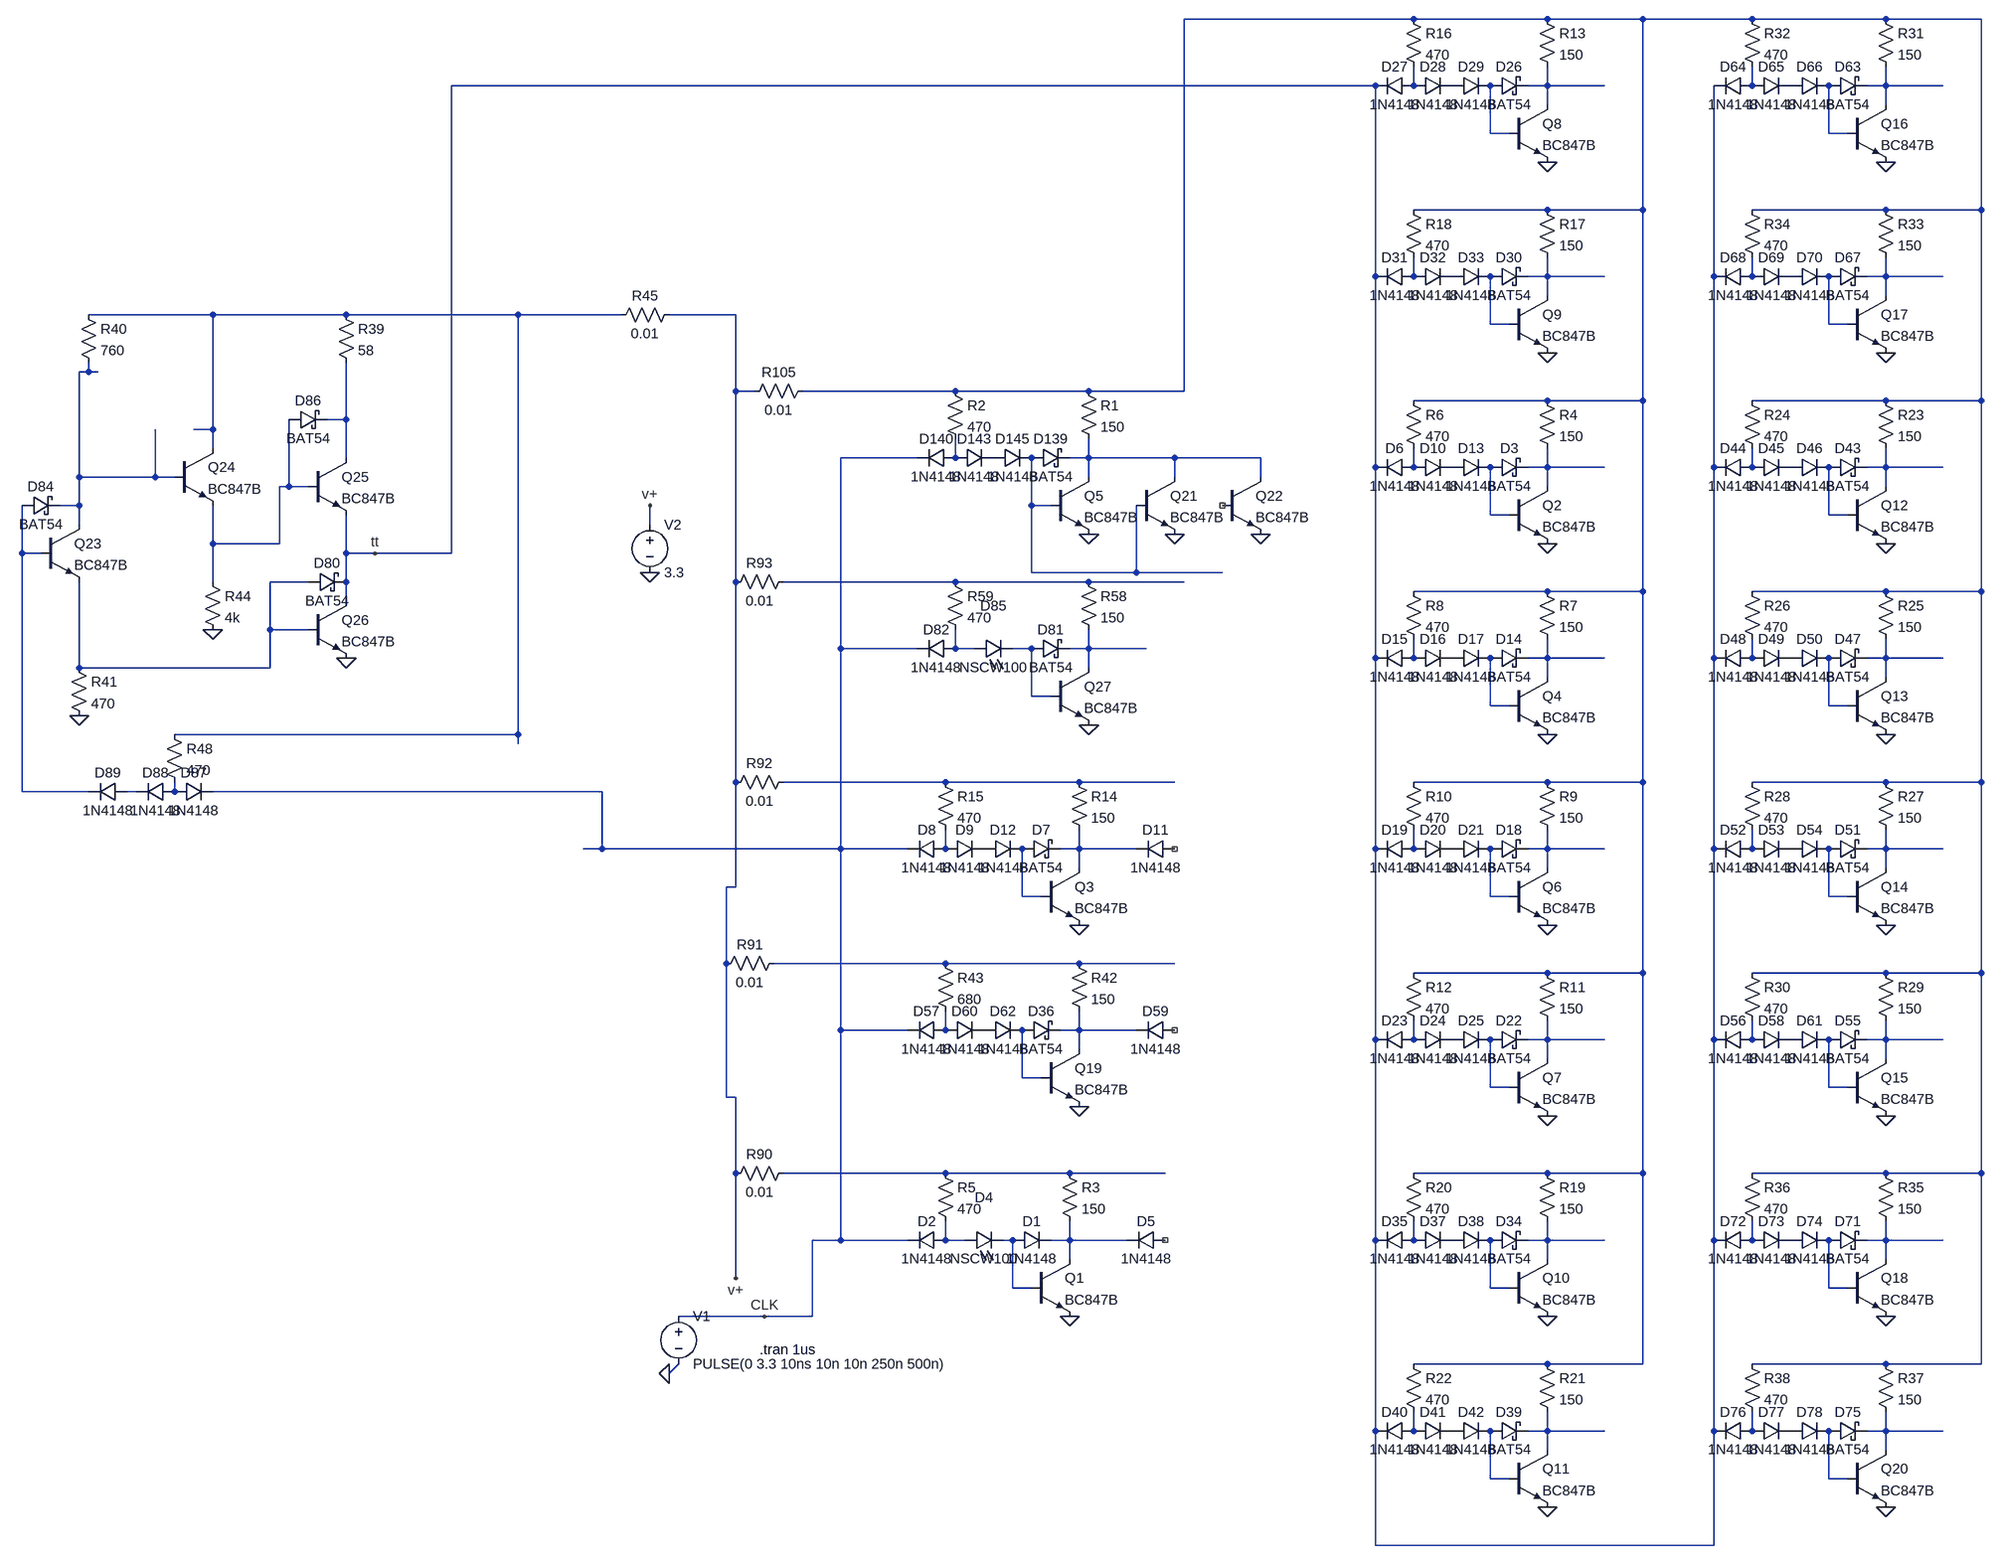
[diagram p0: schematic FanOutTest.asc]
FanOutTest.asc, the LTspice schematic file:
Version 4
SHEET 1 4484 1160
WIRE 1152 -2064 624 -2064
WIRE 1376 -2064 1152 -2064
WIRE 1536 -2064 1376 -2064
WIRE 1728 -2064 1536 -2064
WIRE 1952 -2064 1728 -2064
WIRE 2112 -2064 1952 -2064
WIRE 1088 -1952 -800 -1952
WIRE 1152 -1952 1152 -1984
WIRE 1376 -1952 1376 -1984
WIRE 1376 -1952 1344 -1952
WIRE 1472 -1952 1376 -1952
WIRE 1728 -1952 1728 -1984
WIRE 1952 -1952 1952 -1984
WIRE 1952 -1952 1920 -1952
WIRE 2048 -1952 1952 -1952
WIRE 1376 -1920 1376 -1952
WIRE 1952 -1920 1952 -1952
WIRE 1280 -1872 1280 -1952
WIRE 1312 -1872 1280 -1872
WIRE 1856 -1872 1856 -1952
WIRE 1888 -1872 1856 -1872
WIRE 1376 -1744 1152 -1744
WIRE 1536 -1744 1536 -2064
WIRE 1536 -1744 1376 -1744
WIRE 1952 -1744 1728 -1744
WIRE 2112 -1744 2112 -2064
WIRE 2112 -1744 1952 -1744
WIRE 1088 -1632 1088 -1952
WIRE 1152 -1632 1152 -1664
WIRE 1376 -1632 1376 -1664
WIRE 1376 -1632 1344 -1632
WIRE 1472 -1632 1376 -1632
WIRE 1664 -1632 1664 -1952
WIRE 1728 -1632 1728 -1664
WIRE 1952 -1632 1952 -1664
WIRE 1952 -1632 1920 -1632
WIRE 2048 -1632 1952 -1632
WIRE 1376 -1600 1376 -1632
WIRE 1952 -1600 1952 -1632
WIRE -1200 -1568 -1408 -1568
WIRE -976 -1568 -1200 -1568
WIRE -688 -1568 -976 -1568
WIRE -320 -1568 -688 -1568
WIRE -128 -1568 -240 -1568
WIRE 1280 -1552 1280 -1632
WIRE 1312 -1552 1280 -1552
WIRE 1856 -1552 1856 -1632
WIRE 1888 -1552 1856 -1552
WIRE -1408 -1472 -1408 -1488
WIRE -1408 -1472 -1424 -1472
WIRE -1392 -1472 -1408 -1472
WIRE -128 -1440 -128 -1568
WIRE -96 -1440 -128 -1440
WIRE 240 -1440 -16 -1440
WIRE 464 -1440 240 -1440
WIRE 624 -1440 624 -2064
WIRE 624 -1440 464 -1440
WIRE 1376 -1424 1152 -1424
WIRE 1536 -1424 1536 -1744
WIRE 1536 -1424 1376 -1424
WIRE 1952 -1424 1728 -1424
WIRE 2112 -1424 2112 -1744
WIRE 2112 -1424 1952 -1424
WIRE -976 -1392 -976 -1488
WIRE -976 -1392 -1008 -1392
WIRE -1200 -1376 -1200 -1568
WIRE -1200 -1376 -1232 -1376
WIRE -1200 -1344 -1200 -1376
WIRE -976 -1328 -976 -1392
WIRE 176 -1328 48 -1328
WIRE 240 -1328 240 -1360
WIRE 464 -1328 464 -1360
WIRE 464 -1328 432 -1328
WIRE 608 -1328 464 -1328
WIRE 752 -1328 608 -1328
WIRE 1088 -1312 1088 -1632
WIRE 1152 -1312 1152 -1344
WIRE 1376 -1312 1376 -1344
WIRE 1376 -1312 1344 -1312
WIRE 1472 -1312 1376 -1312
WIRE 1664 -1312 1664 -1632
WIRE 1728 -1312 1728 -1344
WIRE 1952 -1312 1952 -1344
WIRE 1952 -1312 1920 -1312
WIRE 2048 -1312 1952 -1312
WIRE -1424 -1296 -1424 -1472
WIRE -1296 -1296 -1296 -1376
WIRE -1296 -1296 -1424 -1296
WIRE -1264 -1296 -1296 -1296
WIRE 464 -1296 464 -1328
WIRE 608 -1296 608 -1328
WIRE 752 -1296 752 -1328
WIRE -1072 -1280 -1072 -1392
WIRE -1072 -1280 -1088 -1280
WIRE -1040 -1280 -1072 -1280
WIRE 1376 -1280 1376 -1312
WIRE 1952 -1280 1952 -1312
WIRE -1424 -1248 -1424 -1296
WIRE -1424 -1248 -1456 -1248
WIRE 368 -1248 368 -1328
WIRE 400 -1248 368 -1248
WIRE 1280 -1232 1280 -1312
WIRE 1312 -1232 1280 -1232
WIRE 1856 -1232 1856 -1312
WIRE 1888 -1232 1856 -1232
WIRE -1424 -1216 -1424 -1248
WIRE -272 -1216 -272 -1248
WIRE -1200 -1184 -1200 -1248
WIRE -1088 -1184 -1088 -1280
WIRE -1088 -1184 -1200 -1184
WIRE -1520 -1168 -1520 -1248
WIRE -1488 -1168 -1520 -1168
WIRE -976 -1168 -976 -1232
WIRE -928 -1168 -976 -1168
WIRE -800 -1168 -800 -1952
WIRE -800 -1168 -928 -1168
WIRE 368 -1136 368 -1248
WIRE 544 -1136 544 -1248
WIRE 544 -1136 368 -1136
WIRE 688 -1136 544 -1136
WIRE -1200 -1120 -1200 -1184
WIRE -1040 -1120 -1104 -1120
WIRE -976 -1120 -976 -1168
WIRE -128 -1120 -128 -1440
WIRE 240 -1120 -48 -1120
WIRE 464 -1120 240 -1120
WIRE 624 -1120 464 -1120
WIRE 1376 -1104 1152 -1104
WIRE 1536 -1104 1536 -1424
WIRE 1536 -1104 1376 -1104
WIRE 1952 -1104 1728 -1104
WIRE 2112 -1104 2112 -1424
WIRE 2112 -1104 1952 -1104
WIRE -976 -1088 -976 -1120
WIRE -1104 -1040 -1104 -1120
WIRE -1040 -1040 -1104 -1040
WIRE 48 -1008 48 -1328
WIRE 176 -1008 48 -1008
WIRE 240 -1008 240 -1040
WIRE 272 -1008 240 -1008
WIRE 368 -1008 336 -1008
WIRE 464 -1008 464 -1040
WIRE 464 -1008 432 -1008
WIRE 560 -1008 464 -1008
WIRE 1088 -992 1088 -1312
WIRE 1152 -992 1152 -1024
WIRE 1376 -992 1376 -1024
WIRE 1376 -992 1344 -992
WIRE 1472 -992 1376 -992
WIRE 1664 -992 1664 -1312
WIRE 1728 -992 1728 -1024
WIRE 1952 -992 1952 -1024
WIRE 1952 -992 1920 -992
WIRE 2048 -992 1952 -992
WIRE -1424 -976 -1424 -1120
WIRE -1104 -976 -1104 -1040
WIRE -1104 -976 -1424 -976
WIRE 464 -976 464 -1008
WIRE 1376 -960 1376 -992
WIRE 1952 -960 1952 -992
WIRE 368 -928 368 -1008
WIRE 400 -928 368 -928
WIRE 1280 -912 1280 -992
WIRE 1312 -912 1280 -912
WIRE 1856 -912 1856 -992
WIRE 1888 -912 1856 -912
WIRE -688 -864 -688 -1568
WIRE -688 -864 -1264 -864
WIRE -688 -848 -688 -864
WIRE -128 -784 -128 -1120
WIRE 224 -784 -48 -784
WIRE 448 -784 224 -784
WIRE 608 -784 448 -784
WIRE 1376 -784 1152 -784
WIRE 1536 -784 1536 -1104
WIRE 1536 -784 1376 -784
WIRE 1952 -784 1728 -784
WIRE 2112 -784 2112 -1104
WIRE 2112 -784 1952 -784
WIRE -1520 -768 -1520 -1168
WIRE -1408 -768 -1520 -768
WIRE -1328 -768 -1344 -768
WIRE -1264 -768 -1264 -784
WIRE -352 -768 -1200 -768
WIRE -352 -672 -352 -768
WIRE -352 -672 -384 -672
WIRE 48 -672 48 -1008
WIRE 48 -672 -352 -672
WIRE 160 -672 48 -672
WIRE 224 -672 224 -704
WIRE 448 -672 448 -704
WIRE 448 -672 416 -672
WIRE 544 -672 448 -672
WIRE 1088 -672 1088 -992
WIRE 1152 -672 1152 -704
WIRE 1376 -672 1376 -704
WIRE 1376 -672 1344 -672
WIRE 1472 -672 1376 -672
WIRE 1664 -672 1664 -992
WIRE 1728 -672 1728 -704
WIRE 1952 -672 1952 -704
WIRE 1952 -672 1920 -672
WIRE 2048 -672 1952 -672
WIRE 448 -640 448 -672
WIRE 1376 -640 1376 -672
WIRE 1952 -640 1952 -672
WIRE -128 -608 -128 -784
WIRE -128 -608 -144 -608
WIRE 352 -592 352 -672
WIRE 384 -592 352 -592
WIRE 1280 -592 1280 -672
WIRE 1312 -592 1280 -592
WIRE 1856 -592 1856 -672
WIRE 1888 -592 1856 -592
WIRE -144 -480 -144 -608
WIRE 224 -480 -64 -480
WIRE 448 -480 224 -480
WIRE 608 -480 448 -480
WIRE 1376 -464 1152 -464
WIRE 1536 -464 1536 -784
WIRE 1536 -464 1376 -464
WIRE 1952 -464 1728 -464
WIRE 2112 -464 2112 -784
WIRE 2112 -464 1952 -464
WIRE 48 -368 48 -672
WIRE 160 -368 48 -368
WIRE 224 -368 224 -400
WIRE 448 -368 448 -400
WIRE 448 -368 416 -368
WIRE 544 -368 448 -368
WIRE 1088 -352 1088 -672
WIRE 1152 -352 1152 -384
WIRE 1376 -352 1376 -384
WIRE 1376 -352 1344 -352
WIRE 1472 -352 1376 -352
WIRE 1664 -352 1664 -672
WIRE 1728 -352 1728 -384
WIRE 1952 -352 1952 -384
WIRE 1952 -352 1920 -352
WIRE 2048 -352 1952 -352
WIRE 448 -336 448 -368
WIRE 1376 -320 1376 -352
WIRE 1952 -320 1952 -352
WIRE 352 -288 352 -368
WIRE 384 -288 352 -288
WIRE 1280 -272 1280 -352
WIRE 1312 -272 1280 -272
WIRE 1856 -272 1856 -352
WIRE 1888 -272 1856 -272
WIRE -144 -256 -144 -480
WIRE -128 -256 -144 -256
WIRE -128 -128 -128 -256
WIRE 224 -128 -48 -128
WIRE 432 -128 224 -128
WIRE 592 -128 432 -128
WIRE 1376 -128 1152 -128
WIRE 1536 -128 1536 -464
WIRE 1536 -128 1376 -128
WIRE 1952 -128 1728 -128
WIRE 2112 -128 2112 -464
WIRE 2112 -128 1952 -128
WIRE 48 -16 48 -368
WIRE 48 -16 0 -16
WIRE 160 -16 48 -16
WIRE 224 -16 224 -48
WIRE 256 -16 224 -16
WIRE 336 -16 320 -16
WIRE 432 -16 432 -48
WIRE 432 -16 400 -16
WIRE 528 -16 432 -16
WIRE 1088 -16 1088 -352
WIRE 1152 -16 1152 -48
WIRE 1376 -16 1376 -48
WIRE 1376 -16 1344 -16
WIRE 1472 -16 1376 -16
WIRE 1664 -16 1664 -352
WIRE 1728 -16 1728 -48
WIRE 1952 -16 1952 -48
WIRE 1952 -16 1920 -16
WIRE 2048 -16 1952 -16
WIRE 432 16 432 -16
WIRE 1376 16 1376 -16
WIRE 1952 16 1952 -16
WIRE -128 48 -128 -128
WIRE 336 64 336 -16
WIRE 368 64 336 64
WIRE 1280 64 1280 -16
WIRE 1312 64 1280 64
WIRE 1856 64 1856 -16
WIRE 1888 64 1856 64
WIRE -80 112 -224 112
WIRE 0 112 0 -16
WIRE 0 112 -80 112
WIRE 1376 192 1152 192
WIRE 1536 192 1536 -128
WIRE 1536 192 1376 192
WIRE 1952 192 1728 192
WIRE 2112 192 2112 -128
WIRE 2112 192 1952 192
WIRE -240 208 -224 192
WIRE 1088 304 1088 -16
WIRE 1152 304 1152 272
WIRE 1376 304 1376 272
WIRE 1376 304 1344 304
WIRE 1472 304 1376 304
WIRE 1664 304 1664 -16
WIRE 1728 304 1728 272
WIRE 1952 304 1952 272
WIRE 1952 304 1920 304
WIRE 2048 304 1952 304
WIRE 1376 336 1376 304
WIRE 1952 336 1952 304
WIRE 1280 384 1280 304
WIRE 1312 384 1280 384
WIRE 1856 384 1856 304
WIRE 1888 384 1856 384
WIRE 1088 496 1088 304
WIRE 1664 496 1664 304
WIRE 1664 496 1088 496
FLAG -240 208 0
FLAG -272 -1136 0
FLAG -272 -1248 v+
FLAG -80 112 CLK
FLAG 432 112 0
FLAG 448 -544 0
FLAG 464 -880 0
FLAG -128 48 v+
FLAG 448 -240 0
FLAG 1376 -1184 0
FLAG 1376 -864 0
FLAG 1376 -544 0
FLAG 1376 -224 0
FLAG 1376 -1824 0
FLAG 1376 -1504 0
FLAG 1376 112 0
FLAG 1376 432 0
FLAG 1952 -1184 0
FLAG 1952 -864 0
FLAG 1952 -544 0
FLAG 1952 -224 0
FLAG 1952 -1824 0
FLAG 1952 -1504 0
FLAG 1952 112 0
FLAG 1952 432 0
FLAG 608 -1200 0
FLAG 752 -1200 0
FLAG 464 -1200 0
FLAG -1424 -896 0
FLAG -1200 -1040 0
FLAG -976 -992 0
FLAG -928 -1168 tt
SYMBOL voltage -224 96 R0
SYMATTR InstName V1
SYMATTR Value PULSE(0 3.3 10ns 10n 10n 250n 500n)
SYMBOL voltage -272 -1232 R0
SYMATTR InstName V2
SYMATTR Value 3.3
SYMBOL npn 368 16 R0
SYMATTR InstName Q1
SYMATTR Value BC847B
SYMBOL res 416 -144 R0
SYMATTR InstName R3
SYMATTR Value 150
SYMBOL res 208 -144 R0
SYMATTR InstName R5
SYMATTR Value 470
SYMBOL diode 336 0 R270
WINDOW 0 32 32 VTop 2
WINDOW 3 0 32 VBottom 2
SYMATTR InstName D1
SYMATTR Value 1N4148
SYMBOL diode 224 -32 R90
WINDOW 0 0 32 VBottom 2
WINDOW 3 32 32 VTop 2
SYMATTR InstName D2
SYMATTR Value 1N4148
SYMBOL LED 256 0 R270
WINDOW 0 72 32 VTop 2
WINDOW 3 0 32 VBottom 2
SYMATTR InstName D4
SYMATTR Value NSCW100
SYMBOL diode 592 -32 R90
WINDOW 0 0 32 VBottom 2
WINDOW 3 32 32 VTop 2
SYMATTR InstName D5
SYMATTR Value 1N4148
SYMBOL npn 384 -640 R0
SYMATTR InstName Q3
SYMATTR Value BC847B
SYMBOL res 432 -800 R0
SYMATTR InstName R14
SYMATTR Value 150
SYMBOL res 208 -800 R0
SYMATTR InstName R15
SYMATTR Value 470
SYMBOL schottky 352 -656 R270
WINDOW 0 32 32 VTop 2
WINDOW 3 0 32 VBottom 2
SYMATTR InstName D7
SYMATTR Value BAT54
SYMATTR Description Diode
SYMATTR Type diode
SYMBOL diode 224 -688 R90
WINDOW 0 0 32 VBottom 2
WINDOW 3 32 32 VTop 2
SYMATTR InstName D8
SYMATTR Value 1N4148
SYMBOL diode 608 -688 R90
WINDOW 0 0 32 VBottom 2
WINDOW 3 32 32 VTop 2
SYMATTR InstName D11
SYMATTR Value 1N4148
SYMBOL diode 224 -656 R270
WINDOW 0 32 32 VTop 2
WINDOW 3 0 32 VBottom 2
SYMATTR InstName D9
SYMATTR Value 1N4148
SYMBOL diode 288 -656 R270
WINDOW 0 32 32 VTop 2
WINDOW 3 0 32 VBottom 2
SYMATTR InstName D12
SYMATTR Value 1N4148
SYMBOL npn 400 -976 R0
SYMATTR InstName Q27
SYMATTR Value BC847B
SYMBOL res 448 -1136 R0
SYMATTR InstName R58
SYMATTR Value 150
SYMBOL res 224 -1136 R0
SYMATTR InstName R59
SYMATTR Value 470
SYMBOL schottky 368 -992 R270
WINDOW 0 32 32 VTop 2
WINDOW 3 0 32 VBottom 2
SYMATTR InstName D81
SYMATTR Value BAT54
SYMATTR Description Diode
SYMATTR Type diode
SYMBOL diode 240 -1024 R90
WINDOW 0 0 32 VBottom 2
WINDOW 3 32 32 VTop 2
SYMATTR InstName D82
SYMATTR Value 1N4148
SYMBOL LED 272 -992 R270
WINDOW 0 72 32 VTop 2
WINDOW 3 0 32 VBottom 2
SYMATTR InstName D85
SYMATTR Value NSCW100
SYMBOL res -32 -144 R90
WINDOW 0 0 56 VBottom 2
WINDOW 3 32 56 VTop 2
SYMATTR InstName R90
SYMATTR Value 0.01
SYMBOL res -48 -496 R90
WINDOW 0 0 56 VBottom 2
WINDOW 3 32 56 VTop 2
SYMATTR InstName R91
SYMATTR Value 0.01
SYMBOL res -32 -800 R90
WINDOW 0 0 56 VBottom 2
WINDOW 3 32 56 VTop 2
SYMATTR InstName R92
SYMATTR Value 0.01
SYMBOL res -32 -1136 R90
WINDOW 0 0 56 VBottom 2
WINDOW 3 32 56 VTop 2
SYMATTR InstName R93
SYMATTR Value 0.01
SYMBOL npn 384 -336 R0
SYMATTR InstName Q19
SYMATTR Value BC847B
SYMBOL res 432 -496 R0
SYMATTR InstName R42
SYMATTR Value 150
SYMBOL res 208 -496 R0
SYMATTR InstName R43
SYMATTR Value 680
SYMBOL schottky 352 -352 R270
WINDOW 0 32 32 VTop 2
WINDOW 3 0 32 VBottom 2
SYMATTR InstName D36
SYMATTR Value BAT54
SYMATTR Description Diode
SYMATTR Type diode
SYMBOL diode 224 -384 R90
WINDOW 0 0 32 VBottom 2
WINDOW 3 32 32 VTop 2
SYMATTR InstName D57
SYMATTR Value 1N4148
SYMBOL diode 608 -384 R90
WINDOW 0 0 32 VBottom 2
WINDOW 3 32 32 VTop 2
SYMATTR InstName D59
SYMATTR Value 1N4148
SYMBOL diode 224 -352 R270
WINDOW 0 32 32 VTop 2
WINDOW 3 0 32 VBottom 2
SYMATTR InstName D60
SYMATTR Value 1N4148
SYMBOL diode 288 -352 R270
WINDOW 0 32 32 VTop 2
WINDOW 3 0 32 VBottom 2
SYMATTR InstName D62
SYMATTR Value 1N4148
SYMBOL npn 400 -1296 R0
SYMATTR InstName Q5
SYMATTR Value BC847B
SYMBOL res 448 -1456 R0
SYMATTR InstName R1
SYMATTR Value 150
SYMBOL res 224 -1456 R0
SYMATTR InstName R2
SYMATTR Value 470
SYMBOL schottky 368 -1312 R270
WINDOW 0 32 32 VTop 2
WINDOW 3 0 32 VBottom 2
SYMATTR InstName D139
SYMATTR Value BAT54
SYMATTR Description Diode
SYMATTR Type diode
SYMBOL diode 240 -1344 R90
WINDOW 0 0 32 VBottom 2
WINDOW 3 32 32 VTop 2
SYMATTR InstName D140
SYMATTR Value 1N4148
SYMBOL diode 240 -1312 R270
WINDOW 0 32 32 VTop 2
WINDOW 3 0 32 VBottom 2
SYMATTR InstName D143
SYMATTR Value 1N4148
SYMBOL diode 304 -1312 R270
WINDOW 0 32 32 VTop 2
WINDOW 3 0 32 VBottom 2
SYMATTR InstName D145
SYMATTR Value 1N4148
SYMBOL res 0 -1456 R90
WINDOW 0 0 56 VBottom 2
WINDOW 3 32 56 VTop 2
SYMATTR InstName R105
SYMATTR Value 0.01
SYMBOL npn 1312 -1280 R0
SYMATTR InstName Q2
SYMATTR Value BC847B
SYMBOL res 1360 -1440 R0
SYMATTR InstName R4
SYMATTR Value 150
SYMBOL res 1136 -1440 R0
SYMATTR InstName R6
SYMATTR Value 470
SYMBOL schottky 1280 -1296 R270
WINDOW 0 32 32 VTop 2
WINDOW 3 0 32 VBottom 2
SYMATTR InstName D3
SYMATTR Value BAT54
SYMATTR Description Diode
SYMATTR Type diode
SYMBOL diode 1152 -1328 R90
WINDOW 0 0 32 VBottom 2
WINDOW 3 32 32 VTop 2
SYMATTR InstName D6
SYMATTR Value 1N4148
SYMBOL diode 1152 -1296 R270
WINDOW 0 32 32 VTop 2
WINDOW 3 0 32 VBottom 2
SYMATTR InstName D10
SYMATTR Value 1N4148
SYMBOL diode 1216 -1296 R270
WINDOW 0 32 32 VTop 2
WINDOW 3 0 32 VBottom 2
SYMATTR InstName D13
SYMATTR Value 1N4148
SYMBOL npn 1312 -960 R0
SYMATTR InstName Q4
SYMATTR Value BC847B
SYMBOL res 1360 -1120 R0
SYMATTR InstName R7
SYMATTR Value 150
SYMBOL res 1136 -1120 R0
SYMATTR InstName R8
SYMATTR Value 470
SYMBOL schottky 1280 -976 R270
WINDOW 0 32 32 VTop 2
WINDOW 3 0 32 VBottom 2
SYMATTR InstName D14
SYMATTR Value BAT54
SYMATTR Description Diode
SYMATTR Type diode
SYMBOL diode 1152 -1008 R90
WINDOW 0 0 32 VBottom 2
WINDOW 3 32 32 VTop 2
SYMATTR InstName D15
SYMATTR Value 1N4148
SYMBOL diode 1152 -976 R270
WINDOW 0 32 32 VTop 2
WINDOW 3 0 32 VBottom 2
SYMATTR InstName D16
SYMATTR Value 1N4148
SYMBOL diode 1216 -976 R270
WINDOW 0 32 32 VTop 2
WINDOW 3 0 32 VBottom 2
SYMATTR InstName D17
SYMATTR Value 1N4148
SYMBOL npn 1312 -640 R0
SYMATTR InstName Q6
SYMATTR Value BC847B
SYMBOL res 1360 -800 R0
SYMATTR InstName R9
SYMATTR Value 150
SYMBOL res 1136 -800 R0
SYMATTR InstName R10
SYMATTR Value 470
SYMBOL schottky 1280 -656 R270
WINDOW 0 32 32 VTop 2
WINDOW 3 0 32 VBottom 2
SYMATTR InstName D18
SYMATTR Value BAT54
SYMATTR Description Diode
SYMATTR Type diode
SYMBOL diode 1152 -688 R90
WINDOW 0 0 32 VBottom 2
WINDOW 3 32 32 VTop 2
SYMATTR InstName D19
SYMATTR Value 1N4148
SYMBOL diode 1152 -656 R270
WINDOW 0 32 32 VTop 2
WINDOW 3 0 32 VBottom 2
SYMATTR InstName D20
SYMATTR Value 1N4148
SYMBOL diode 1216 -656 R270
WINDOW 0 32 32 VTop 2
WINDOW 3 0 32 VBottom 2
SYMATTR InstName D21
SYMATTR Value 1N4148
SYMBOL npn 1312 -320 R0
SYMATTR InstName Q7
SYMATTR Value BC847B
SYMBOL res 1360 -480 R0
SYMATTR InstName R11
SYMATTR Value 150
SYMBOL res 1136 -480 R0
SYMATTR InstName R12
SYMATTR Value 470
SYMBOL schottky 1280 -336 R270
WINDOW 0 32 32 VTop 2
WINDOW 3 0 32 VBottom 2
SYMATTR InstName D22
SYMATTR Value BAT54
SYMATTR Description Diode
SYMATTR Type diode
SYMBOL diode 1152 -368 R90
WINDOW 0 0 32 VBottom 2
WINDOW 3 32 32 VTop 2
SYMATTR InstName D23
SYMATTR Value 1N4148
SYMBOL diode 1152 -336 R270
WINDOW 0 32 32 VTop 2
WINDOW 3 0 32 VBottom 2
SYMATTR InstName D24
SYMATTR Value 1N4148
SYMBOL diode 1216 -336 R270
WINDOW 0 32 32 VTop 2
WINDOW 3 0 32 VBottom 2
SYMATTR InstName D25
SYMATTR Value 1N4148
SYMBOL npn 1312 -1920 R0
SYMATTR InstName Q8
SYMATTR Value BC847B
SYMBOL res 1360 -2080 R0
SYMATTR InstName R13
SYMATTR Value 150
SYMBOL res 1136 -2080 R0
SYMATTR InstName R16
SYMATTR Value 470
SYMBOL schottky 1280 -1936 R270
WINDOW 0 32 32 VTop 2
WINDOW 3 0 32 VBottom 2
SYMATTR InstName D26
SYMATTR Value BAT54
SYMATTR Description Diode
SYMATTR Type diode
SYMBOL diode 1152 -1968 R90
WINDOW 0 0 32 VBottom 2
WINDOW 3 32 32 VTop 2
SYMATTR InstName D27
SYMATTR Value 1N4148
SYMBOL diode 1152 -1936 R270
WINDOW 0 32 32 VTop 2
WINDOW 3 0 32 VBottom 2
SYMATTR InstName D28
SYMATTR Value 1N4148
SYMBOL diode 1216 -1936 R270
WINDOW 0 32 32 VTop 2
WINDOW 3 0 32 VBottom 2
SYMATTR InstName D29
SYMATTR Value 1N4148
SYMBOL npn 1312 -1600 R0
SYMATTR InstName Q9
SYMATTR Value BC847B
SYMBOL res 1360 -1760 R0
SYMATTR InstName R17
SYMATTR Value 150
SYMBOL res 1136 -1760 R0
SYMATTR InstName R18
SYMATTR Value 470
SYMBOL schottky 1280 -1616 R270
WINDOW 0 32 32 VTop 2
WINDOW 3 0 32 VBottom 2
SYMATTR InstName D30
SYMATTR Value BAT54
SYMATTR Description Diode
SYMATTR Type diode
SYMBOL diode 1152 -1648 R90
WINDOW 0 0 32 VBottom 2
WINDOW 3 32 32 VTop 2
SYMATTR InstName D31
SYMATTR Value 1N4148
SYMBOL diode 1152 -1616 R270
WINDOW 0 32 32 VTop 2
WINDOW 3 0 32 VBottom 2
SYMATTR InstName D32
SYMATTR Value 1N4148
SYMBOL diode 1216 -1616 R270
WINDOW 0 32 32 VTop 2
WINDOW 3 0 32 VBottom 2
SYMATTR InstName D33
SYMATTR Value 1N4148
SYMBOL npn 1312 16 R0
SYMATTR InstName Q10
SYMATTR Value BC847B
SYMBOL res 1360 -144 R0
SYMATTR InstName R19
SYMATTR Value 150
SYMBOL res 1136 -144 R0
SYMATTR InstName R20
SYMATTR Value 470
SYMBOL schottky 1280 0 R270
WINDOW 0 32 32 VTop 2
WINDOW 3 0 32 VBottom 2
SYMATTR InstName D34
SYMATTR Value BAT54
SYMATTR Description Diode
SYMATTR Type diode
SYMBOL diode 1152 -32 R90
WINDOW 0 0 32 VBottom 2
WINDOW 3 32 32 VTop 2
SYMATTR InstName D35
SYMATTR Value 1N4148
SYMBOL diode 1152 0 R270
WINDOW 0 32 32 VTop 2
WINDOW 3 0 32 VBottom 2
SYMATTR InstName D37
SYMATTR Value 1N4148
SYMBOL diode 1216 0 R270
WINDOW 0 32 32 VTop 2
WINDOW 3 0 32 VBottom 2
SYMATTR InstName D38
SYMATTR Value 1N4148
SYMBOL npn 1312 336 R0
SYMATTR InstName Q11
SYMATTR Value BC847B
SYMBOL res 1360 176 R0
SYMATTR InstName R21
SYMATTR Value 150
SYMBOL res 1136 176 R0
SYMATTR InstName R22
SYMATTR Value 470
SYMBOL schottky 1280 320 R270
WINDOW 0 32 32 VTop 2
WINDOW 3 0 32 VBottom 2
SYMATTR InstName D39
SYMATTR Value BAT54
SYMATTR Description Diode
SYMATTR Type diode
SYMBOL diode 1152 288 R90
WINDOW 0 0 32 VBottom 2
WINDOW 3 32 32 VTop 2
SYMATTR InstName D40
SYMATTR Value 1N4148
SYMBOL diode 1152 320 R270
WINDOW 0 32 32 VTop 2
WINDOW 3 0 32 VBottom 2
SYMATTR InstName D41
SYMATTR Value 1N4148
SYMBOL diode 1216 320 R270
WINDOW 0 32 32 VTop 2
WINDOW 3 0 32 VBottom 2
SYMATTR InstName D42
SYMATTR Value 1N4148
SYMBOL npn 1888 -1280 R0
SYMATTR InstName Q12
SYMATTR Value BC847B
SYMBOL res 1936 -1440 R0
SYMATTR InstName R23
SYMATTR Value 150
SYMBOL res 1712 -1440 R0
SYMATTR InstName R24
SYMATTR Value 470
SYMBOL schottky 1856 -1296 R270
WINDOW 0 32 32 VTop 2
WINDOW 3 0 32 VBottom 2
SYMATTR InstName D43
SYMATTR Value BAT54
SYMATTR Description Diode
SYMATTR Type diode
SYMBOL diode 1728 -1328 R90
WINDOW 0 0 32 VBottom 2
WINDOW 3 32 32 VTop 2
SYMATTR InstName D44
SYMATTR Value 1N4148
SYMBOL diode 1728 -1296 R270
WINDOW 0 32 32 VTop 2
WINDOW 3 0 32 VBottom 2
SYMATTR InstName D45
SYMATTR Value 1N4148
SYMBOL diode 1792 -1296 R270
WINDOW 0 32 32 VTop 2
WINDOW 3 0 32 VBottom 2
SYMATTR InstName D46
SYMATTR Value 1N4148
SYMBOL npn 1888 -960 R0
SYMATTR InstName Q13
SYMATTR Value BC847B
SYMBOL res 1936 -1120 R0
SYMATTR InstName R25
SYMATTR Value 150
SYMBOL res 1712 -1120 R0
SYMATTR InstName R26
SYMATTR Value 470
SYMBOL schottky 1856 -976 R270
WINDOW 0 32 32 VTop 2
WINDOW 3 0 32 VBottom 2
SYMATTR InstName D47
SYMATTR Value BAT54
SYMATTR Description Diode
SYMATTR Type diode
SYMBOL diode 1728 -1008 R90
WINDOW 0 0 32 VBottom 2
WINDOW 3 32 32 VTop 2
SYMATTR InstName D48
SYMATTR Value 1N4148
SYMBOL diode 1728 -976 R270
WINDOW 0 32 32 VTop 2
WINDOW 3 0 32 VBottom 2
SYMATTR InstName D49
SYMATTR Value 1N4148
SYMBOL diode 1792 -976 R270
WINDOW 0 32 32 VTop 2
WINDOW 3 0 32 VBottom 2
SYMATTR InstName D50
SYMATTR Value 1N4148
SYMBOL npn 1888 -640 R0
SYMATTR InstName Q14
SYMATTR Value BC847B
SYMBOL res 1936 -800 R0
SYMATTR InstName R27
SYMATTR Value 150
SYMBOL res 1712 -800 R0
SYMATTR InstName R28
SYMATTR Value 470
SYMBOL schottky 1856 -656 R270
WINDOW 0 32 32 VTop 2
WINDOW 3 0 32 VBottom 2
SYMATTR InstName D51
SYMATTR Value BAT54
SYMATTR Description Diode
SYMATTR Type diode
SYMBOL diode 1728 -688 R90
WINDOW 0 0 32 VBottom 2
WINDOW 3 32 32 VTop 2
SYMATTR InstName D52
SYMATTR Value 1N4148
SYMBOL diode 1728 -656 R270
WINDOW 0 32 32 VTop 2
WINDOW 3 0 32 VBottom 2
SYMATTR InstName D53
SYMATTR Value 1N4148
SYMBOL diode 1792 -656 R270
WINDOW 0 32 32 VTop 2
WINDOW 3 0 32 VBottom 2
SYMATTR InstName D54
SYMATTR Value 1N4148
SYMBOL npn 1888 -320 R0
SYMATTR InstName Q15
SYMATTR Value BC847B
SYMBOL res 1936 -480 R0
SYMATTR InstName R29
SYMATTR Value 150
SYMBOL res 1712 -480 R0
SYMATTR InstName R30
SYMATTR Value 470
SYMBOL schottky 1856 -336 R270
WINDOW 0 32 32 VTop 2
WINDOW 3 0 32 VBottom 2
SYMATTR InstName D55
SYMATTR Value BAT54
SYMATTR Description Diode
SYMATTR Type diode
SYMBOL diode 1728 -368 R90
WINDOW 0 0 32 VBottom 2
WINDOW 3 32 32 VTop 2
SYMATTR InstName D56
SYMATTR Value 1N4148
SYMBOL diode 1728 -336 R270
WINDOW 0 32 32 VTop 2
WINDOW 3 0 32 VBottom 2
SYMATTR InstName D58
SYMATTR Value 1N4148
SYMBOL diode 1792 -336 R270
WINDOW 0 32 32 VTop 2
WINDOW 3 0 32 VBottom 2
SYMATTR InstName D61
SYMATTR Value 1N4148
SYMBOL npn 1888 -1920 R0
SYMATTR InstName Q16
SYMATTR Value BC847B
SYMBOL res 1936 -2080 R0
SYMATTR InstName R31
SYMATTR Value 150
SYMBOL res 1712 -2080 R0
SYMATTR InstName R32
SYMATTR Value 470
SYMBOL schottky 1856 -1936 R270
WINDOW 0 32 32 VTop 2
WINDOW 3 0 32 VBottom 2
SYMATTR InstName D63
SYMATTR Value BAT54
SYMATTR Description Diode
SYMATTR Type diode
SYMBOL diode 1728 -1968 R90
WINDOW 0 0 32 VBottom 2
WINDOW 3 32 32 VTop 2
SYMATTR InstName D64
SYMATTR Value 1N4148
SYMBOL diode 1728 -1936 R270
WINDOW 0 32 32 VTop 2
WINDOW 3 0 32 VBottom 2
SYMATTR InstName D65
SYMATTR Value 1N4148
SYMBOL diode 1792 -1936 R270
WINDOW 0 32 32 VTop 2
WINDOW 3 0 32 VBottom 2
SYMATTR InstName D66
SYMATTR Value 1N4148
SYMBOL npn 1888 -1600 R0
SYMATTR InstName Q17
SYMATTR Value BC847B
SYMBOL res 1936 -1760 R0
SYMATTR InstName R33
SYMATTR Value 150
SYMBOL res 1712 -1760 R0
SYMATTR InstName R34
SYMATTR Value 470
SYMBOL schottky 1856 -1616 R270
WINDOW 0 32 32 VTop 2
WINDOW 3 0 32 VBottom 2
SYMATTR InstName D67
SYMATTR Value BAT54
SYMATTR Description Diode
SYMATTR Type diode
SYMBOL diode 1728 -1648 R90
WINDOW 0 0 32 VBottom 2
WINDOW 3 32 32 VTop 2
SYMATTR InstName D68
SYMATTR Value 1N4148
SYMBOL diode 1728 -1616 R270
WINDOW 0 32 32 VTop 2
WINDOW 3 0 32 VBottom 2
SYMATTR InstName D69
SYMATTR Value 1N4148
SYMBOL diode 1792 -1616 R270
WINDOW 0 32 32 VTop 2
WINDOW 3 0 32 VBottom 2
SYMATTR InstName D70
SYMATTR Value 1N4148
SYMBOL npn 1888 16 R0
SYMATTR InstName Q18
SYMATTR Value BC847B
SYMBOL res 1936 -144 R0
SYMATTR InstName R35
SYMATTR Value 150
SYMBOL res 1712 -144 R0
SYMATTR InstName R36
SYMATTR Value 470
SYMBOL schottky 1856 0 R270
WINDOW 0 32 32 VTop 2
WINDOW 3 0 32 VBottom 2
SYMATTR InstName D71
SYMATTR Value BAT54
SYMATTR Description Diode
SYMATTR Type diode
SYMBOL diode 1728 -32 R90
WINDOW 0 0 32 VBottom 2
WINDOW 3 32 32 VTop 2
SYMATTR InstName D72
SYMATTR Value 1N4148
SYMBOL diode 1728 0 R270
WINDOW 0 32 32 VTop 2
WINDOW 3 0 32 VBottom 2
SYMATTR InstName D73
SYMATTR Value 1N4148
SYMBOL diode 1792 0 R270
WINDOW 0 32 32 VTop 2
WINDOW 3 0 32 VBottom 2
SYMATTR InstName D74
SYMATTR Value 1N4148
SYMBOL npn 1888 336 R0
SYMATTR InstName Q20
SYMATTR Value BC847B
SYMBOL res 1936 176 R0
SYMATTR InstName R37
SYMATTR Value 150
SYMBOL res 1712 176 R0
SYMATTR InstName R38
SYMATTR Value 470
SYMBOL schottky 1856 320 R270
WINDOW 0 32 32 VTop 2
WINDOW 3 0 32 VBottom 2
SYMATTR InstName D75
SYMATTR Value BAT54
SYMATTR Description Diode
SYMATTR Type diode
SYMBOL diode 1728 288 R90
WINDOW 0 0 32 VBottom 2
WINDOW 3 32 32 VTop 2
SYMATTR InstName D76
SYMATTR Value 1N4148
SYMBOL diode 1728 320 R270
WINDOW 0 32 32 VTop 2
WINDOW 3 0 32 VBottom 2
SYMATTR InstName D77
SYMATTR Value 1N4148
SYMBOL diode 1792 320 R270
WINDOW 0 32 32 VTop 2
WINDOW 3 0 32 VBottom 2
SYMATTR InstName D78
SYMATTR Value 1N4148
SYMBOL npn 544 -1296 R0
SYMATTR InstName Q21
SYMATTR Value BC847B
SYMBOL npn 688 -1296 R0
SYMATTR InstName Q22
SYMATTR Value BC847B
SYMBOL npn -1488 -1216 R0
SYMATTR InstName Q23
SYMATTR Value BC847B
SYMBOL npn -1264 -1344 R0
SYMATTR InstName Q24
SYMATTR Value BC847B
SYMBOL npn -1040 -1328 R0
SYMATTR InstName Q25
SYMATTR Value BC847B
SYMBOL npn -1040 -1088 R0
SYMATTR InstName Q26
SYMATTR Value BC847B
SYMBOL res -992 -1584 R0
SYMATTR InstName R39
SYMATTR Value 58
SYMBOL res -1424 -1584 R0
SYMATTR InstName R40
SYMATTR Value 760
SYMBOL res -1440 -992 R0
SYMATTR InstName R41
SYMATTR Value 470
SYMBOL res -1216 -1136 R0
SYMATTR InstName R44
SYMATTR Value 4k
SYMBOL res -224 -1584 R90
WINDOW 0 0 56 VBottom 2
WINDOW 3 32 56 VTop 2
SYMATTR InstName R45
SYMATTR Value 0.01
SYMBOL schottky -1040 -1104 R270
WINDOW 0 32 32 VTop 2
WINDOW 3 0 32 VBottom 2
SYMATTR InstName D80
SYMATTR Value BAT54
SYMATTR Description Diode
SYMATTR Type diode
SYMBOL schottky -1520 -1232 R270
WINDOW 0 32 32 VTop 2
WINDOW 3 0 32 VBottom 2
SYMATTR InstName D84
SYMATTR Value BAT54
SYMATTR Description Diode
SYMATTR Type diode
SYMBOL schottky -1072 -1376 R270
WINDOW 0 32 32 VTop 2
WINDOW 3 0 32 VBottom 2
SYMATTR InstName D86
SYMATTR Value BAT54
SYMATTR Description Diode
SYMATTR Type diode
SYMBOL diode -1264 -784 M90
WINDOW 0 0 32 VBottom 2
WINDOW 3 32 32 VTop 2
SYMATTR InstName D87
SYMATTR Value 1N4148
SYMBOL diode -1264 -752 M270
WINDOW 0 32 32 VTop 2
WINDOW 3 0 32 VBottom 2
SYMATTR InstName D88
SYMATTR Value 1N4148
SYMBOL diode -1344 -752 M270
WINDOW 0 32 32 VTop 2
WINDOW 3 0 32 VBottom 2
SYMATTR InstName D89
SYMATTR Value 1N4148
SYMBOL res -1280 -880 R0
SYMATTR InstName R48
SYMATTR Value 470
TEXT -88 168 Left 2 !.tran 1us

The netlist it stands for:
* FanOutTest.asc
V1 CLK 0 PULSE(0 3.3 10ns 10n 10n 250n 500n)
V2 v+ 0 3.3
Q1 N064 N063 0 0 BC847B
R3 N061 N064 150
R5 N061 N062 470
D1 N063 N064 1N4148
D2 N062 CLK 1N4148
D4 N062 N063 NSCW100
D5 NC_01 N064 1N4148
Q3 N043 N048 0 0 BC847B
R14 N039 N043 150
R15 N039 N042 470
D7 N048 N043 BAT54
D8 N042 CLK 1N4148
D11 NC_02 N043 1N4148
D9 N042 P001 1N4148
D12 P001 N048 1N4148
Q27 N032 N031 0 0 BC847B
R58 N029 N032 150
R59 N029 N030 470
D81 N031 N032 BAT54
D82 N030 CLK 1N4148
D85 N030 N031 NSCW100
R90 N061 v+ 0.01
R91 N051 v+ 0.01
R92 N039 v+ 0.01
R93 N029 v+ 0.01
Q19 N053 N058 0 0 BC847B
R42 N051 N053 150
R43 N051 N052 680
D36 N058 N053 BAT54
D57 N052 CLK 1N4148
D59 NC_03 N053 1N4148
D60 N052 P002 1N4148
D62 P002 N058 1N4148
Q5 N018 N024 0 0 BC847B
R1 N001 N018 150
R2 N001 N017 470
D139 N024 N018 BAT54
D140 N017 CLK 1N4148
D143 N017 P003 1N4148
D145 P003 N024 1N4148
R105 N001 v+ 0.01
Q2 N020 N025 0 0 BC847B
R4 N001 N020 150
R6 N001 N019 470
D3 N025 N020 BAT54
D6 N019 tt 1N4148
D10 N019 P004 1N4148
D13 P004 N025 1N4148
Q4 N034 N037 0 0 BC847B
R7 N001 N034 150
R8 N001 N033 470
D14 N037 N034 BAT54
D15 N033 tt 1N4148
D16 N033 P005 1N4148
D17 P005 N037 1N4148
Q6 N045 N049 0 0 BC847B
R9 N001 N045 150
R10 N001 N044 470
D18 N049 N045 BAT54
D19 N044 tt 1N4148
D20 N044 P006 1N4148
D21 P006 N049 1N4148
Q7 N055 N059 0 0 BC847B
R11 N001 N055 150
R12 N001 N054 470
D22 N059 N055 BAT54
D23 N054 tt 1N4148
D24 N054 P007 1N4148
D25 P007 N059 1N4148
Q8 N003 N006 0 0 BC847B
R13 N001 N003 150
R16 N001 N002 470
D26 N006 N003 BAT54
D27 N002 tt 1N4148
D28 N002 P008 1N4148
D29 P008 N006 1N4148
Q9 N009 N013 0 0 BC847B
R17 N001 N009 150
R18 N001 N008 470
D30 N013 N009 BAT54
D31 N008 tt 1N4148
D32 N008 P009 1N4148
D33 P009 N013 1N4148
Q10 N066 N069 0 0 BC847B
R19 N001 N066 150
R20 N001 N065 470
D34 N069 N066 BAT54
D35 N065 tt 1N4148
D37 N065 P010 1N4148
D38 P010 N069 1N4148
Q11 N072 N075 0 0 BC847B
R21 N001 N072 150
R22 N001 N071 470
D39 N075 N072 BAT54
D40 N071 tt 1N4148
D41 N071 P011 1N4148
D42 P011 N075 1N4148
Q12 N022 N026 0 0 BC847B
R23 N001 N022 150
R24 N001 N021 470
D43 N026 N022 BAT54
D44 N021 tt 1N4148
D45 N021 P012 1N4148
D46 P012 N026 1N4148
Q13 N036 N038 0 0 BC847B
R25 N001 N036 150
R26 N001 N035 470
D47 N038 N036 BAT54
D48 N035 tt 1N4148
D49 N035 P013 1N4148
D50 P013 N038 1N4148
Q14 N047 N050 0 0 BC847B
R27 N001 N047 150
R28 N001 N046 470
D51 N050 N047 BAT54
D52 N046 tt 1N4148
D53 N046 P014 1N4148
D54 P014 N050 1N4148
Q15 N057 N060 0 0 BC847B
R29 N001 N057 150
R30 N001 N056 470
D55 N060 N057 BAT54
D56 N056 tt 1N4148
D58 N056 P015 1N4148
D61 P015 N060 1N4148
Q16 N005 N007 0 0 BC847B
R31 N001 N005 150
R32 N001 N004 470
D63 N007 N005 BAT54
D64 N004 tt 1N4148
D65 N004 P016 1N4148
D66 P016 N007 1N4148
Q17 N011 N014 0 0 BC847B
R33 N001 N011 150
R34 N001 N010 470
D67 N014 N011 BAT54
D68 N010 tt 1N4148
D69 N010 P017 1N4148
D70 P017 N014 1N4148
Q18 N068 N070 0 0 BC847B
R35 N001 N068 150
R36 N001 N067 470
D71 N070 N068 BAT54
D72 N067 tt 1N4148
D73 N067 P018 1N4148
D74 P018 N070 1N4148
Q20 N074 N076 0 0 BC847B
R37 N001 N074 150
R38 N001 N073 470
D75 N076 N074 BAT54
D76 N073 tt 1N4148
D77 N073 P019 1N4148
D78 P019 N076 1N4148
Q21 N018 N024 0 0 BC847B
Q22 N018 NC_04 0 0 BC847B
Q23 N015 N027 N028 0 BC847B
Q24 N012 N015 N023 0 BC847B
Q25 N016 N023 tt 0 BC847B
Q26 tt N028 0 0 BC847B
R39 N012 N016 58
R40 N012 N015 760
R41 N028 0 470
R44 N023 0 4k
R45 v+ N012 0.01
D80 N028 tt BAT54
D84 N027 N015 BAT54
D86 N023 N016 BAT54
D87 N041 CLK 1N4148
D88 N041 N040 1N4148
D89 N040 N027 1N4148
R48 N012 N041 470
.model D D
.lib standard.dio
.model NPN NPN
.model PNP PNP
.lib standard.bjt
.tran 1us
.backanno
.end